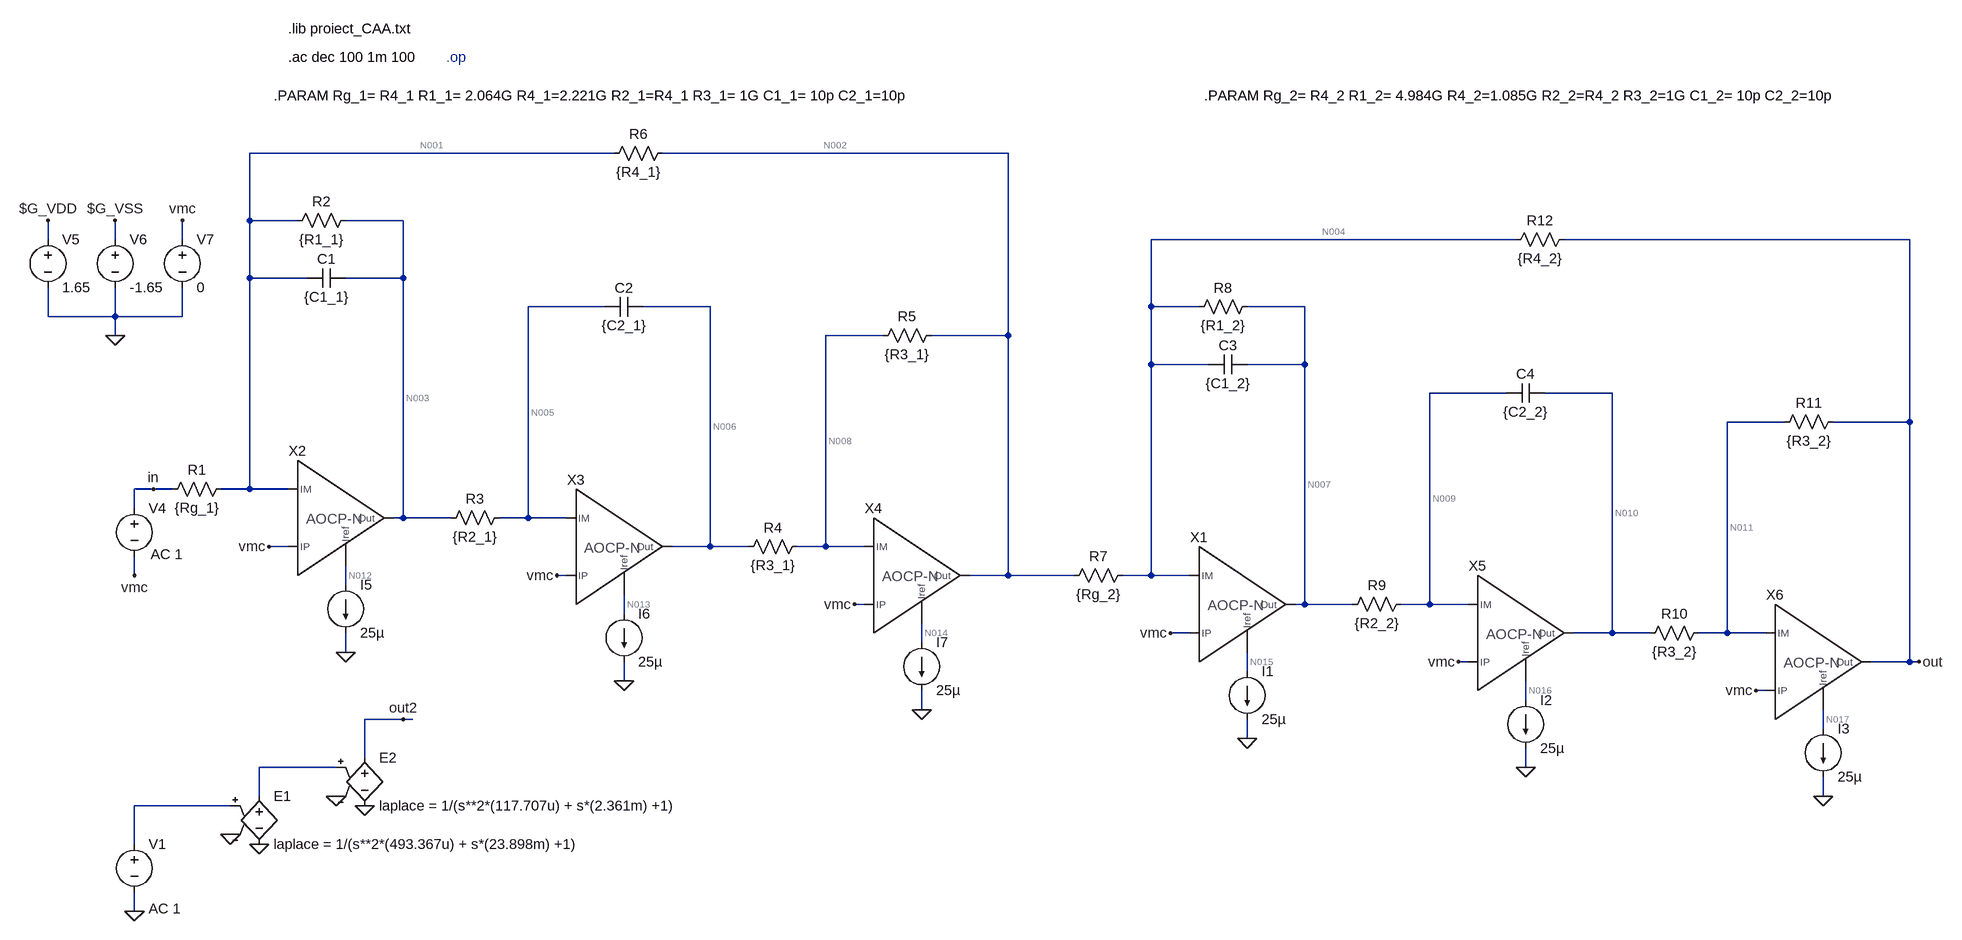
[diagram p0: schematic test_biquad_real.asc]
test_biquad_real.asc, the LTspice schematic file:
Version 4
SHEET 1 3528 1108
WIRE 1104 -176 496 -176
WIRE 1760 -176 1184 -176
WIRE 496 -64 496 -176
WIRE 576 -64 496 -64
WIRE 752 -64 656 -64
WIRE 160 -32 160 -64
WIRE 272 -32 272 -64
WIRE 384 -32 384 -64
WIRE 2720 -32 2112 -32
WIRE 3376 -32 2800 -32
WIRE 496 32 496 -64
WIRE 592 32 496 32
WIRE 752 32 752 -64
WIRE 752 32 656 32
WIRE 1088 80 960 80
WIRE 1264 80 1152 80
WIRE 2112 80 2112 -32
WIRE 2192 80 2112 80
WIRE 2368 80 2272 80
WIRE 160 96 160 48
WIRE 272 96 272 48
WIRE 272 96 160 96
WIRE 384 96 384 48
WIRE 384 96 272 96
WIRE 272 128 272 96
WIRE 1552 128 1456 128
WIRE 1760 128 1760 -176
WIRE 1760 128 1632 128
WIRE 2112 176 2112 80
WIRE 2208 176 2112 176
WIRE 2368 176 2368 80
WIRE 2368 176 2272 176
WIRE 2704 224 2576 224
WIRE 2880 224 2768 224
WIRE 3168 272 3072 272
WIRE 3376 272 3376 -32
WIRE 3376 272 3248 272
WIRE 336 384 304 384
WIRE 368 384 336 384
WIRE 496 384 496 32
WIRE 496 384 448 384
WIRE 560 384 496 384
WIRE 304 416 304 384
WIRE 752 432 752 32
WIRE 752 432 736 432
WIRE 832 432 752 432
WIRE 960 432 960 80
WIRE 960 432 912 432
WIRE 1024 432 960 432
WIRE 560 480 528 480
WIRE 1264 480 1264 80
WIRE 1264 480 1200 480
WIRE 1328 480 1264 480
WIRE 1456 480 1456 128
WIRE 1456 480 1408 480
WIRE 1520 480 1456 480
WIRE 304 528 304 496
WIRE 1024 528 1008 528
WIRE 1760 528 1760 128
WIRE 1760 528 1696 528
WIRE 1984 528 1760 528
WIRE 2112 528 2112 176
WIRE 2112 528 2064 528
WIRE 2176 528 2112 528
WIRE 656 544 656 512
WIRE 1520 576 1504 576
WIRE 2368 576 2368 176
WIRE 2368 576 2352 576
WIRE 2448 576 2368 576
WIRE 2576 576 2576 224
WIRE 2576 576 2528 576
WIRE 2640 576 2576 576
WIRE 1120 592 1120 560
WIRE 2176 624 2144 624
WIRE 2880 624 2880 224
WIRE 2880 624 2816 624
WIRE 2944 624 2880 624
WIRE 3072 624 3072 272
WIRE 3072 624 3024 624
WIRE 3136 624 3072 624
WIRE 1616 640 1616 608
WIRE 656 656 656 624
WIRE 2640 672 2624 672
WIRE 3376 672 3376 272
WIRE 3376 672 3312 672
WIRE 3392 672 3376 672
WIRE 2272 688 2272 656
WIRE 1120 704 1120 672
WIRE 3136 720 3120 720
WIRE 2736 736 2736 704
WIRE 1616 752 1616 720
WIRE 752 768 688 768
WIRE 768 768 752 768
WIRE 3232 784 3232 752
WIRE 2272 800 2272 768
WIRE 688 832 688 768
WIRE 640 848 512 848
WIRE 2736 848 2736 816
WIRE 512 896 512 848
WIRE 3232 896 3232 864
WIRE 464 912 304 912
WIRE 304 976 304 912
WIRE 304 1088 304 1056
FLAG 304 528 vmc
FLAG 528 480 vmc
FLAG 336 384 in
FLAG 1008 528 vmc
FLAG 1504 576 vmc
FLAG 272 128 0
FLAG 160 -64 $G_VDD
FLAG 272 -64 $G_VSS
FLAG 384 -64 vmc
FLAG 464 960 0
FLAG 512 976 0
FLAG 640 896 0
FLAG 688 912 0
FLAG 304 1088 0
FLAG 752 768 out2
FLAG 656 656 0
FLAG 1120 704 0
FLAG 1616 752 0
FLAG 3392 672 out
FLAG 2144 624 vmc
FLAG 2624 672 vmc
FLAG 3120 720 vmc
FLAG 2272 800 0
FLAG 2736 848 0
FLAG 3232 896 0
SYMBOL voltage 304 400 R0
WINDOW 3 29 109 Left 2
WINDOW 123 27 93 Left 2
WINDOW 39 0 0 Left 2
SYMATTR Value ""
SYMATTR Value2 AC 1
SYMATTR InstName V4
SYMBOL res 464 368 R90
WINDOW 0 0 56 VBottom 2
WINDOW 3 32 56 VTop 2
SYMATTR InstName R1
SYMATTR Value {Rg_1}
SYMBOL res 928 416 R90
WINDOW 0 0 56 VBottom 2
WINDOW 3 32 56 VTop 2
SYMATTR InstName R3
SYMATTR Value {R2_1}
SYMBOL res 1424 464 R90
WINDOW 0 0 56 VBottom 2
WINDOW 3 32 56 VTop 2
SYMATTR InstName R4
SYMATTR Value {R3_1}
SYMBOL voltage 160 -48 R0
WINDOW 123 0 0 Left 2
WINDOW 39 0 0 Left 2
SYMATTR InstName V5
SYMATTR Value 1.65
SYMBOL voltage 272 -48 R0
WINDOW 123 0 0 Left 2
WINDOW 39 0 0 Left 2
SYMATTR InstName V6
SYMATTR Value -1.65
SYMBOL voltage 384 -48 R0
WINDOW 123 0 0 Left 2
WINDOW 39 0 0 Left 2
SYMATTR InstName V7
SYMATTR Value 0
SYMBOL e 512 880 R0
SYMATTR InstName E1
SYMATTR Value laplace = 1/(s**2*(493.367u) + s*(23.898m) +1)
SYMBOL e 688 816 R0
SYMATTR InstName E2
SYMATTR Value laplace = 1/(s**2*(117.707u) + s*(2.361m) +1)
SYMBOL voltage 304 960 R0
WINDOW 123 24 124 Left 2
WINDOW 39 0 0 Left 0
WINDOW 3 24 44 Left 2
SYMATTR Value2 AC 1
SYMATTR Value ""
SYMATTR InstName V1
SYMBOL ao_cp_n 608 432 R0
SYMATTR InstName X2
SYMBOL current 656 544 R0
WINDOW 123 0 0 Left 0
WINDOW 39 0 0 Left 0
SYMATTR InstName I5
SYMATTR Value 25µ
SYMBOL ao_cp_n 1072 480 R0
SYMATTR InstName X3
SYMBOL current 1120 592 R0
WINDOW 123 0 0 Left 0
WINDOW 39 0 0 Left 0
SYMATTR InstName I6
SYMATTR Value 25µ
SYMBOL ao_cp_n 1568 528 R0
SYMATTR InstName X4
SYMBOL current 1616 640 R0
WINDOW 123 0 0 Left 0
WINDOW 39 0 0 Left 0
SYMATTR InstName I7
SYMATTR Value 25µ
SYMBOL res 2080 512 R90
WINDOW 0 0 56 VBottom 2
WINDOW 3 32 56 VTop 2
SYMATTR InstName R7
SYMATTR Value {Rg_2}
SYMBOL res 2544 560 R90
WINDOW 0 0 56 VBottom 2
WINDOW 3 32 56 VTop 2
SYMATTR InstName R9
SYMATTR Value {R2_2}
SYMBOL res 3040 608 R90
WINDOW 0 0 56 VBottom 2
WINDOW 3 32 56 VTop 2
SYMATTR InstName R10
SYMATTR Value {R3_2}
SYMBOL ao_cp_n 2224 576 R0
SYMATTR InstName X1
SYMBOL current 2272 688 R0
WINDOW 123 0 0 Left 0
WINDOW 39 0 0 Left 0
SYMATTR InstName I1
SYMATTR Value 25µ
SYMBOL ao_cp_n 2688 624 R0
SYMATTR InstName X5
SYMBOL current 2736 736 R0
WINDOW 123 0 0 Left 0
WINDOW 39 0 0 Left 0
SYMATTR InstName I2
SYMATTR Value 25µ
SYMBOL ao_cp_n 3184 672 R0
SYMATTR InstName X6
SYMBOL current 3232 784 R0
WINDOW 123 0 0 Left 0
WINDOW 39 0 0 Left 0
SYMATTR InstName I3
SYMATTR Value 25µ
SYMBOL cap 656 16 R90
WINDOW 0 0 32 VBottom 2
WINDOW 3 32 32 VTop 2
SYMATTR InstName C1
SYMATTR Value {C1_1}
SYMBOL res 672 -80 R90
WINDOW 0 0 56 VBottom 2
WINDOW 3 32 56 VTop 2
SYMATTR InstName R2
SYMATTR Value {R1_1}
SYMBOL cap 1152 64 R90
WINDOW 0 0 32 VBottom 2
WINDOW 3 32 32 VTop 2
SYMATTR InstName C2
SYMATTR Value {C2_1}
SYMBOL res 1648 112 R90
WINDOW 0 0 56 VBottom 2
WINDOW 3 32 56 VTop 2
SYMATTR InstName R5
SYMATTR Value {R3_1}
SYMBOL res 1200 -192 R90
WINDOW 0 0 56 VBottom 2
WINDOW 3 32 56 VTop 2
SYMATTR InstName R6
SYMATTR Value {R4_1}
SYMBOL cap 2272 160 R90
WINDOW 0 0 32 VBottom 2
WINDOW 3 32 32 VTop 2
SYMATTR InstName C3
SYMATTR Value {C1_2}
SYMBOL res 2288 64 R90
WINDOW 0 0 56 VBottom 2
WINDOW 3 32 56 VTop 2
SYMATTR InstName R8
SYMATTR Value {R1_2}
SYMBOL cap 2768 208 R90
WINDOW 0 0 32 VBottom 2
WINDOW 3 32 32 VTop 2
SYMATTR InstName C4
SYMATTR Value {C2_2}
SYMBOL res 3264 256 R90
WINDOW 0 0 56 VBottom 2
WINDOW 3 32 56 VTop 2
SYMATTR InstName R11
SYMATTR Value {R3_2}
SYMBOL res 2816 -48 R90
WINDOW 0 0 56 VBottom 2
WINDOW 3 32 56 VTop 2
SYMATTR InstName R12
SYMATTR Value {R4_2}
TEXT 560 -384 Left 2 !.lib proiect_CAA.txt
TEXT 560 -336 Left 2 !.ac dec 100 1m 100
TEXT 536 -272 Left 2 !.PARAM Rg_1= R4_1 R1_1= 2.064G R4_1=2.221G R2_1=R4_1 R3_1= 1G C1_1= 10p C2_1=10p
TEXT 2200 -272 Left 2 !.PARAM Rg_2= R4_2 R1_2= 4.984G R4_2=1.085G R2_2=R4_2 R3_2=1G C1_2= 10p C2_2=10p
TEXT 824 -336 Left 2 ;.op

The netlist it stands for:
* test_biquad_real.asc
V4 in vmc AC 1
R1 N001 in {Rg_1}
R3 N005 N003 {R2_1}
R4 N008 N006 {R3_1}
V5 $G_VDD 0 1.65
V6 $G_VSS 0 -1.65
V7 vmc 0 0
E1 N018 0 N019 0 laplace = 1/(s**2*(493.367u) + s*(23.898m) +1)
E2 out2 0 N018 0 laplace = 1/(s**2*(117.707u) + s*(2.361m) +1)
V1 N019 0 AC 1
XX2 N001 vmc N003 N012 ao_cp_n  ; pins IM IP Out Iref
I5 N012 0 25µ
XX3 N005 vmc N006 N013 ao_cp_n  ; pins IM IP Out Iref
I6 N013 0 25µ
XX4 N008 vmc N002 N014 ao_cp_n  ; pins IM IP Out Iref
I7 N014 0 25µ
R7 N004 N002 {Rg_2}
R9 N009 N007 {R2_2}
R10 N011 N010 {R3_2}
XX1 N004 vmc N007 N015 ao_cp_n  ; pins IM IP Out Iref
I1 N015 0 25µ
XX5 N009 vmc N010 N016 ao_cp_n  ; pins IM IP Out Iref
I2 N016 0 25µ
XX6 N011 vmc out N017 ao_cp_n  ; pins IM IP Out Iref
I3 N017 0 25µ
C1 N003 N001 {C1_1}
R2 N003 N001 {R1_1}
C2 N006 N005 {C2_1}
R5 N002 N008 {R3_1}
R6 N002 N001 {R4_1}
C3 N007 N004 {C1_2}
R8 N007 N004 {R1_2}
C4 N010 N009 {C2_2}
R11 out N011 {R3_2}
R12 out N004 {R4_2}
.lib proiect_CAA.txt
.ac dec 100 1m 100
.PARAM Rg_1= R4_1 R1_1= 2.064G R4_1=2.221G R2_1=R4_1 R3_1= 1G C1_1= 10p C2_1=10p
.PARAM Rg_2= R4_2 R1_2= 4.984G R4_2=1.085G R2_2=R4_2 R3_2=1G C1_2= 10p C2_2=10p
* .op
.backanno
.end

* Results of the author's LTspice run, read from the files saved beside the schematic
* Operating Point, zero values left out:
*   V(n001) = -81.64 mV
*   V(n005) = -120.9 mV
*   V(n003) = -120.9 mV
*   V(n008) = -121.2 mV
*   V(n006) = -121.5 mV
*   V($g_vdd) = 1.65 V
*   V($g_vss) = -1.65 V
*   V(n012) = 251.8 mV
*   V(n013) = 251.8 mV
*   V(n014) = 251.8 mV
*   V(n002) = -121 mV
*   V(n004) = -121.3 mV
*   V(n009) = -121.5 mV
*   V(n007) = -121.5 mV
*   V(n011) = -121.5 mV
*   V(n010) = -121.5 mV
*   V(n015) = 251.8 mV
*   V(n016) = 251.8 mV
*   V(n017) = 251.8 mV
*   V(out) = -121.5 mV
*   I(I5) = 25 µA
*   I(I6) = 25 µA
*   I(I7) = 25 µA
*   I(I1) = 25 µA
*   I(I2) = 25 µA
*   I(I3) = 25 µA
*   I(R1) = -36.76 pA
*   I(R2) = -19.04 pA
*   I(R6) = -17.72 pA
*   I(V4) = -36.76 pA
*   I(V5) = -1.867 mA
*   I(V6) = 1.717 mA
*   I(V7) = -36.76 pA
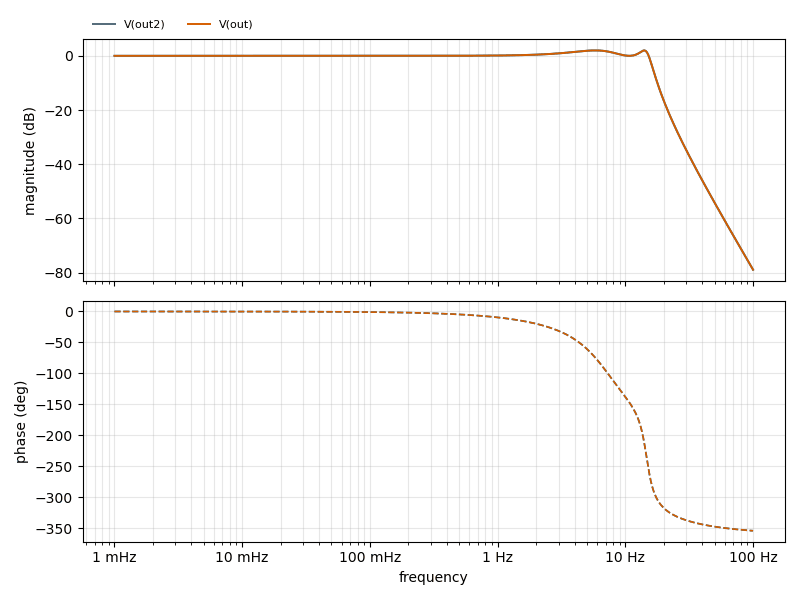
[diagram p1: AC Analysis of test_biquad_real.asc, plotted from the saved traces]
* AC Analysis, 1 run:
*   V(out2): 0.00 dB at 1 mHz, -78.93 dB at 100 Hz, peak 2.00 dB at 5.888 Hz, 3 dB below the peak at 15.5 Hz
*   V(out): -0.00 dB at 1 mHz, -78.93 dB at 100 Hz, peak 2.00 dB at 5.888 Hz, 3 dB below the peak at 15.5 Hz